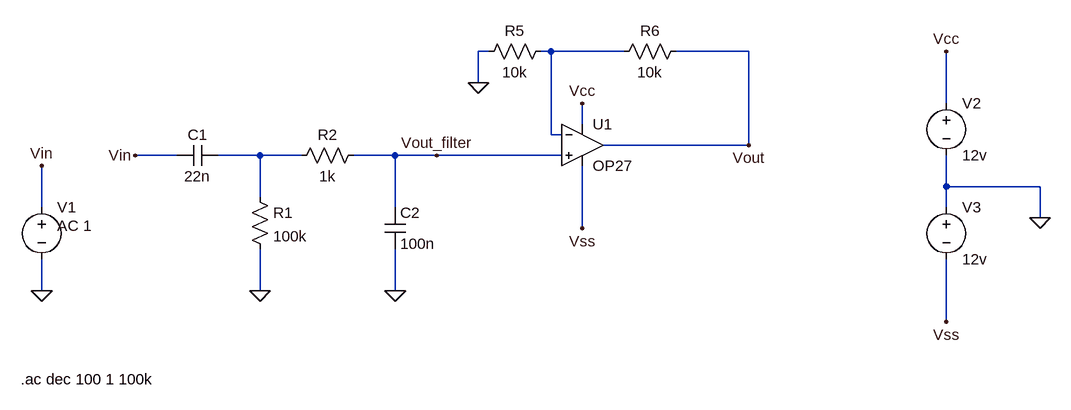
[diagram p0: schematic Draft1.asc]
Draft1.asc, the LTspice schematic file:
Version 4
SHEET 1 1332 680
WIRE 464 -48 448 -48
WIRE 560 -48 544 -48
WIRE 672 -48 560 -48
WIRE 864 -48 752 -48
WIRE 448 0 448 -48
WIRE 1168 32 1168 -48
WIRE 608 64 608 32
WIRE 560 80 560 -48
WIRE 576 80 560 80
WIRE 864 96 864 -48
WIRE 864 96 640 96
WIRE -16 112 -80 112
WIRE 112 112 48 112
WIRE 176 112 112 112
WIRE 320 112 256 112
WIRE 384 112 320 112
WIRE 576 112 384 112
WIRE 1168 160 1168 112
WIRE 1312 160 1168 160
WIRE 112 176 112 112
WIRE -224 192 -224 128
WIRE 320 192 320 112
WIRE 1168 192 1168 160
WIRE 1312 208 1312 160
WIRE 608 224 608 128
WIRE -224 320 -224 272
WIRE 112 320 112 256
WIRE 320 320 320 256
WIRE 1168 368 1168 272
FLAG 112 320 0
FLAG 320 320 0
FLAG -224 320 0
FLAG -224 128 Vin
FLAG -80 112 Vin
FLAG 384 112 Vout_filter
FLAG 608 224 Vss
FLAG 608 32 Vcc
FLAG 448 0 0
FLAG 864 96 Vout
FLAG 1168 368 Vss
FLAG 1168 -48 Vcc
FLAG 1312 208 0
SYMBOL cap 48 96 R90
WINDOW 0 0 32 VBottom 2
WINDOW 3 32 32 VTop 2
SYMATTR InstName C1
SYMATTR Value 22n
SYMBOL res 96 160 R0
SYMATTR InstName R1
SYMATTR Value 100k
SYMBOL res 272 96 R90
WINDOW 0 0 56 VBottom 2
WINDOW 3 32 56 VTop 2
SYMATTR InstName R2
SYMATTR Value 1k
SYMBOL cap 304 192 R0
SYMATTR InstName C2
SYMATTR Value 100n
SYMBOL Opamps\\OP27 608 32 R0
SYMATTR InstName U1
SYMBOL res 560 -64 R90
WINDOW 0 0 56 VBottom 2
WINDOW 3 32 56 VTop 2
SYMATTR InstName R5
SYMATTR Value 10k
SYMBOL res 768 -64 R90
WINDOW 0 0 56 VBottom 2
WINDOW 3 32 56 VTop 2
SYMATTR InstName R6
SYMATTR Value 10k
SYMBOL voltage 1168 16 R0
WINDOW 123 0 0 Left 0
WINDOW 39 0 0 Left 0
SYMATTR InstName V2
SYMATTR Value 12v
SYMBOL voltage 1168 176 R0
WINDOW 123 0 0 Left 0
WINDOW 39 0 0 Left 0
SYMATTR InstName V3
SYMATTR Value 12v
SYMBOL voltage -224 176 R0
WINDOW 123 24 44 Left 2
WINDOW 39 0 0 Left 0
SYMATTR Value2 AC 1
SYMATTR InstName V1
SYMATTR Value ""
TEXT -256 456 Left 2 !.ac dec 100 1 100k

The netlist it stands for:
* Draft1.asc
C1 N002 Vin 22n
R1 N002 0 100k
R2 Vout_filter N002 1k
C2 Vout_filter 0 100n
XU1 Vout_filter N001 Vcc Vss Vout OP27  ; pins In+ In- V+ V- OUT
R5 N001 0 10k
R6 Vout N001 10k
V2 Vcc 0 12v
V3 0 Vss 12v
V1 Vin 0 AC 1
.ac dec 100 1 100k
.lib ADI.lib
.backanno
.end

* Results of the author's LTspice run, read from the files saved beside the schematic
* Operating Point, zero values left out:
*   V(vcc) = 12 V
*   V(vss) = -12 V
*   I(V3) = -2.666 mA
*   I(V2) = -2.666 mA
*   Ix(u1:3) = 2.666 mA
*   Ix(u1:4) = -2.666 mA
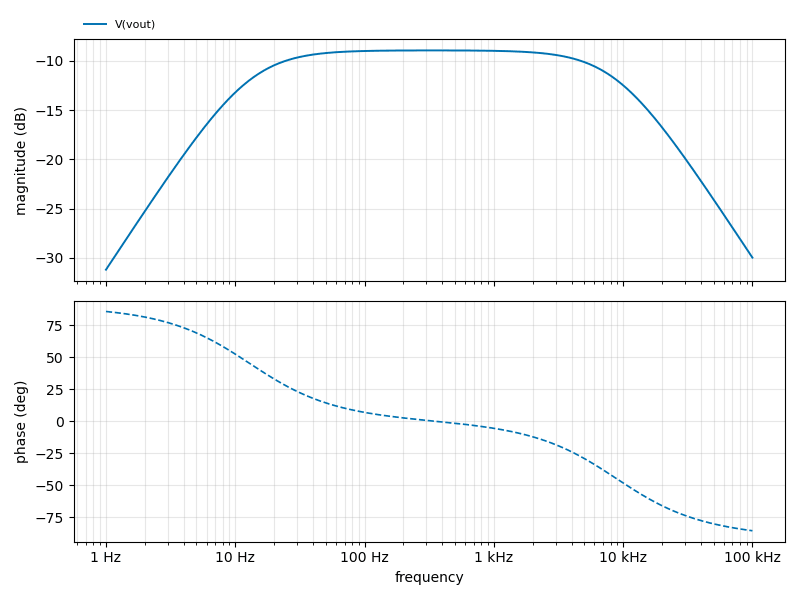
[diagram p1: AC Analysis of Draft1.asc, plotted from the saved traces]
* AC Analysis, 1 run:
*   V(vout): -31.19 dB at 1 Hz, -29.97 dB at 100 kHz, peak -8.93 dB at 338.8 Hz, 3 dB below the peak at 12.92 Hz and 8.911 kHz